# EAGLE schematic untitled (EAGLE 7.7.0)
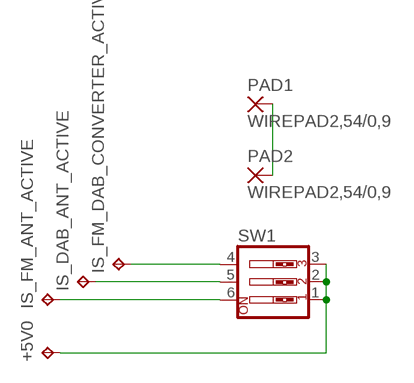
[diagram p0: schematic, sheet 1]

## Parts
+5V0  TPPAD1-13  [P1-13]
IS_DAB_ANT_ACTIVE  TPPAD1-13  [P1-13]
IS_FM_ANT_ACTIVE  TPPAD1-13  [P1-13]
IS_FM_DAB_CONVERTER_ACTIVE  TPPAD1-13  [P1-13]
PAD1  WIREPAD2,54/0,9  [2,54/0,9]
PAD2  WIREPAD2,54/0,9  [2,54/0,9]
SW1  SW_DIP-3  [EDG-03]

## Nets
N$1: +5V0.TP SW1.1 SW1.2 SW1.3
N$2: IS_FM_ANT_ACTIVE.TP SW1.6
N$3: IS_DAB_ANT_ACTIVE.TP SW1.5
N$4: IS_FM_DAB_CONVERTER_ACTIVE.TP SW1.4
STRUCTURAL_REINFORCEMENT: PAD1.1(P) PAD2.1(P)

## Library data of the parts
+5V0 IS_DAB_ANT_ACTIVE IS_FM_ANT_ACTIVE IS_FM_DAB_CONVERTER_ACTIVE = testpad:TP: Test pad
PAD1 PAD2 = wirepad:WIREPAD: Wire PAD connect wire on PCB
SW1 = special:SW_DIP-3: DIP SWITCH